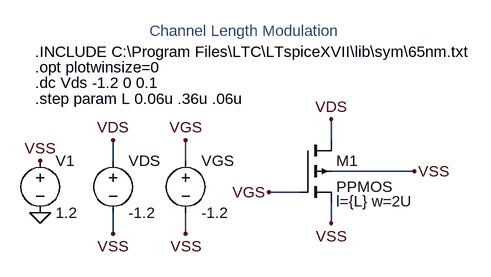
[diagram p0: schematic 7Channel Length Modulation pmos.asc]
7Channel Length Modulation pmos.asc, the LTspice schematic file:
Version 4
SHEET 1 880 680
WIRE 176 -464 176 -496
WIRE -160 -432 -160 -464
WIRE -48 -432 -48 -464
WIRE 304 -416 176 -416
WIRE 128 -384 80 -384
WIRE 176 -336 176 -368
WIRE -160 -320 -160 -352
WIRE -48 -320 -48 -352
FLAG -48 -464 VGS
FLAG -160 -464 VDS
FLAG -272 -432 VSS
FLAG -272 -352 0
FLAG -160 -320 VSS
FLAG -48 -320 VSS
FLAG 80 -384 VGS
FLAG 176 -496 VDS
FLAG 176 -336 VSS
FLAG 304 -416 VSS
SYMBOL voltage -160 -448 R0
SYMATTR InstName VDS
SYMATTR Value -1.2
SYMBOL voltage -48 -448 R0
WINDOW 123 0 0 Left 0
WINDOW 39 0 0 Left 0
SYMATTR InstName VGS
SYMATTR Value -1.2
SYMBOL voltage -272 -448 R0
SYMATTR InstName V1
SYMATTR Value 1.2
SYMBOL pmos4 128 -464 R0
WINDOW 123 56 94 Left 2
SYMATTR InstName M1
SYMATTR Value PPMOS
SYMATTR Value2 l={L} w=2U
TEXT -280 -600 Left 2 !.INCLUDE C:\\Program Files\\LTC\\LTspiceXVII\\lib\\sym\\65nm.txt
TEXT -280 -576 Left 2 !.opt plotwinsize=0
TEXT -280 -552 Left 2 !.dc Vds -1.2 0 0.1
TEXT -280 -528 Left 2 !.step param L 0.06u .36u .06u
TEXT -104 -632 Left 2 ;Channel Length Modulation

The netlist it stands for:
* 7Channel Length Modulation pmos.asc
VDS VDS VSS -1.2
VGS VGS VSS -1.2
V1 VSS 0 1.2
M1 VDS VGS VSS VSS PPMOS l={L} w=2U
.model NMOS NMOS
.model PMOS PMOS
.lib standard.mos
.INCLUDE C:\Program Files\LTC\LTspiceXVII\lib\sym\65nm.txt
.opt plotwinsize=0
.dc Vds -1.2 0 0.1
.step param L 0.06u .36u .06u
* Channel Length Modulation
.backanno
.end